# EAGLE design LED Controller (EAGLE 7.4.0)

## Sheet 1 of 5: Display
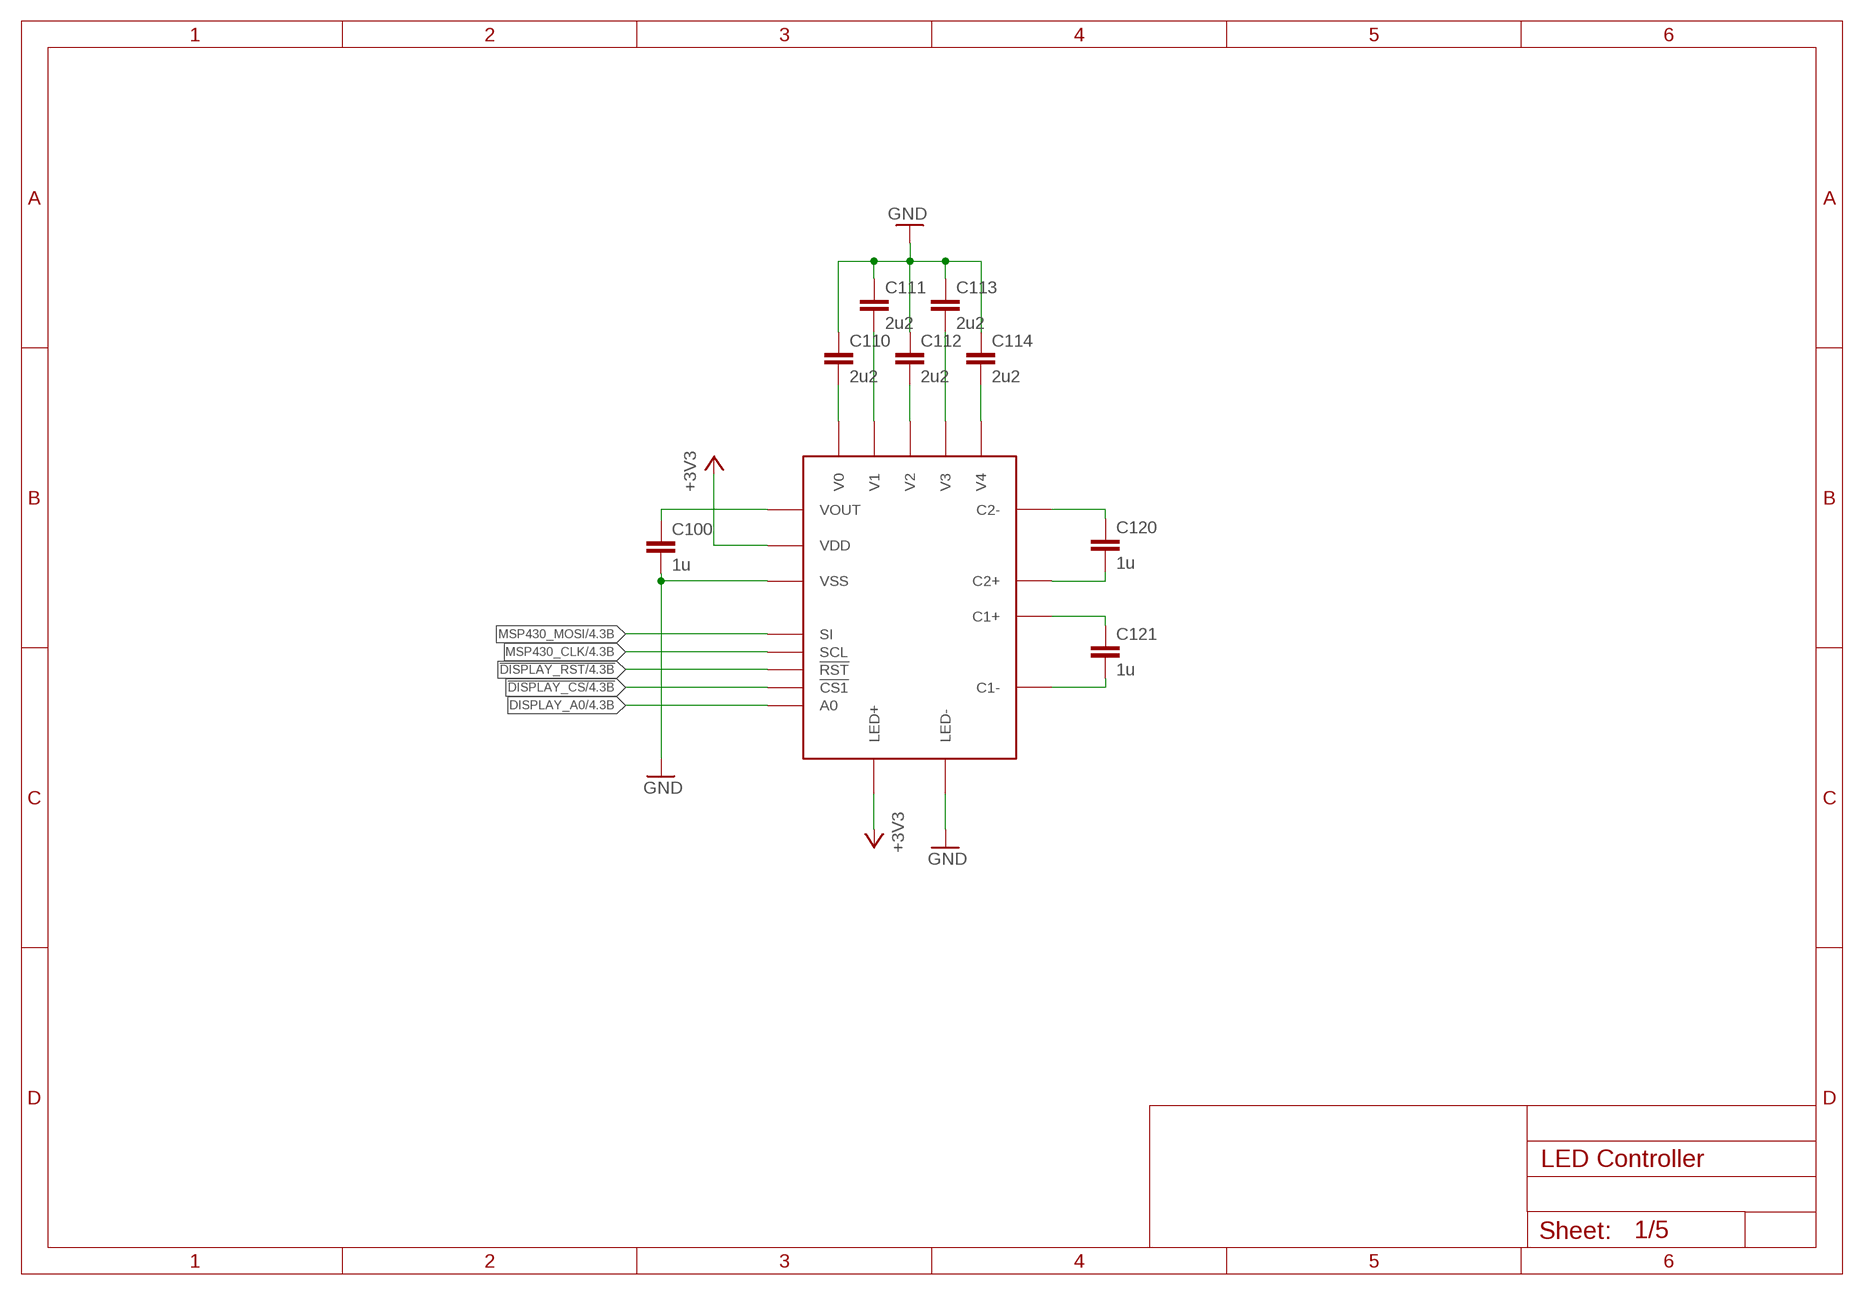
[diagram p0: schematic, sheet 1]

### Parts
C100  1u  C-EUC0603  [C0603]
C110  2u2  C-EUC0603  [C0603]
C111  2u2  C-EUC0603  [C0603]
C112  2u2  C-EUC0603  [C0603]
C113  2u2  C-EUC0603  [C0603]
C114  2u2  C-EUC0603  [C0603]
C120  1u  C-EUC0603  [C0603]
C121  1u  C-EUC0603  [C0603]
U$3  DISPLAY  [NHD-C12832A1Z-NSW-BBW-3V3]

### Nets
!DISPLAY_CS: U$3.P17(!CS1) ; also sheet 4
!DISPLAY_RST: U$3.P16(!RST) ; also sheet 4
+3V3: U$3.A(LED+) U$3.P12(VDD) ; also sheet 3,4,5
DISPLAY_A0: U$3.P15(A0) ; also sheet 4
GND: C100.2 C110.1 C111.1 C112.1 C113.1 C114.1 U$3.K(LED-) U$3.P11(VSS) ; also sheet 2,3,4,5
MSP430_CLK: U$3.P14(SCL) ; also sheet 4
MSP430_MOSI: U$3.P13(SI) ; also sheet 4
N$7: C110.2 U$3.P1(V0)
N$11: C111.2 U$3.P2(V1)
N$12: C112.2 U$3.P3(V2)
N$13: C113.2 U$3.P4(V3)
N$14: C114.2 U$3.P5(V4)
N$16: C120.2 U$3.P7(C2+)
N$17: C120.1 U$3.P6(C2-)
N$18: C121.1 U$3.P8(C1+)
N$19: C121.2 U$3.P9(C1-)
N$20: C100.1 U$3.P10(VOUT)

## Sheet 2 of 5: Boosted Converter
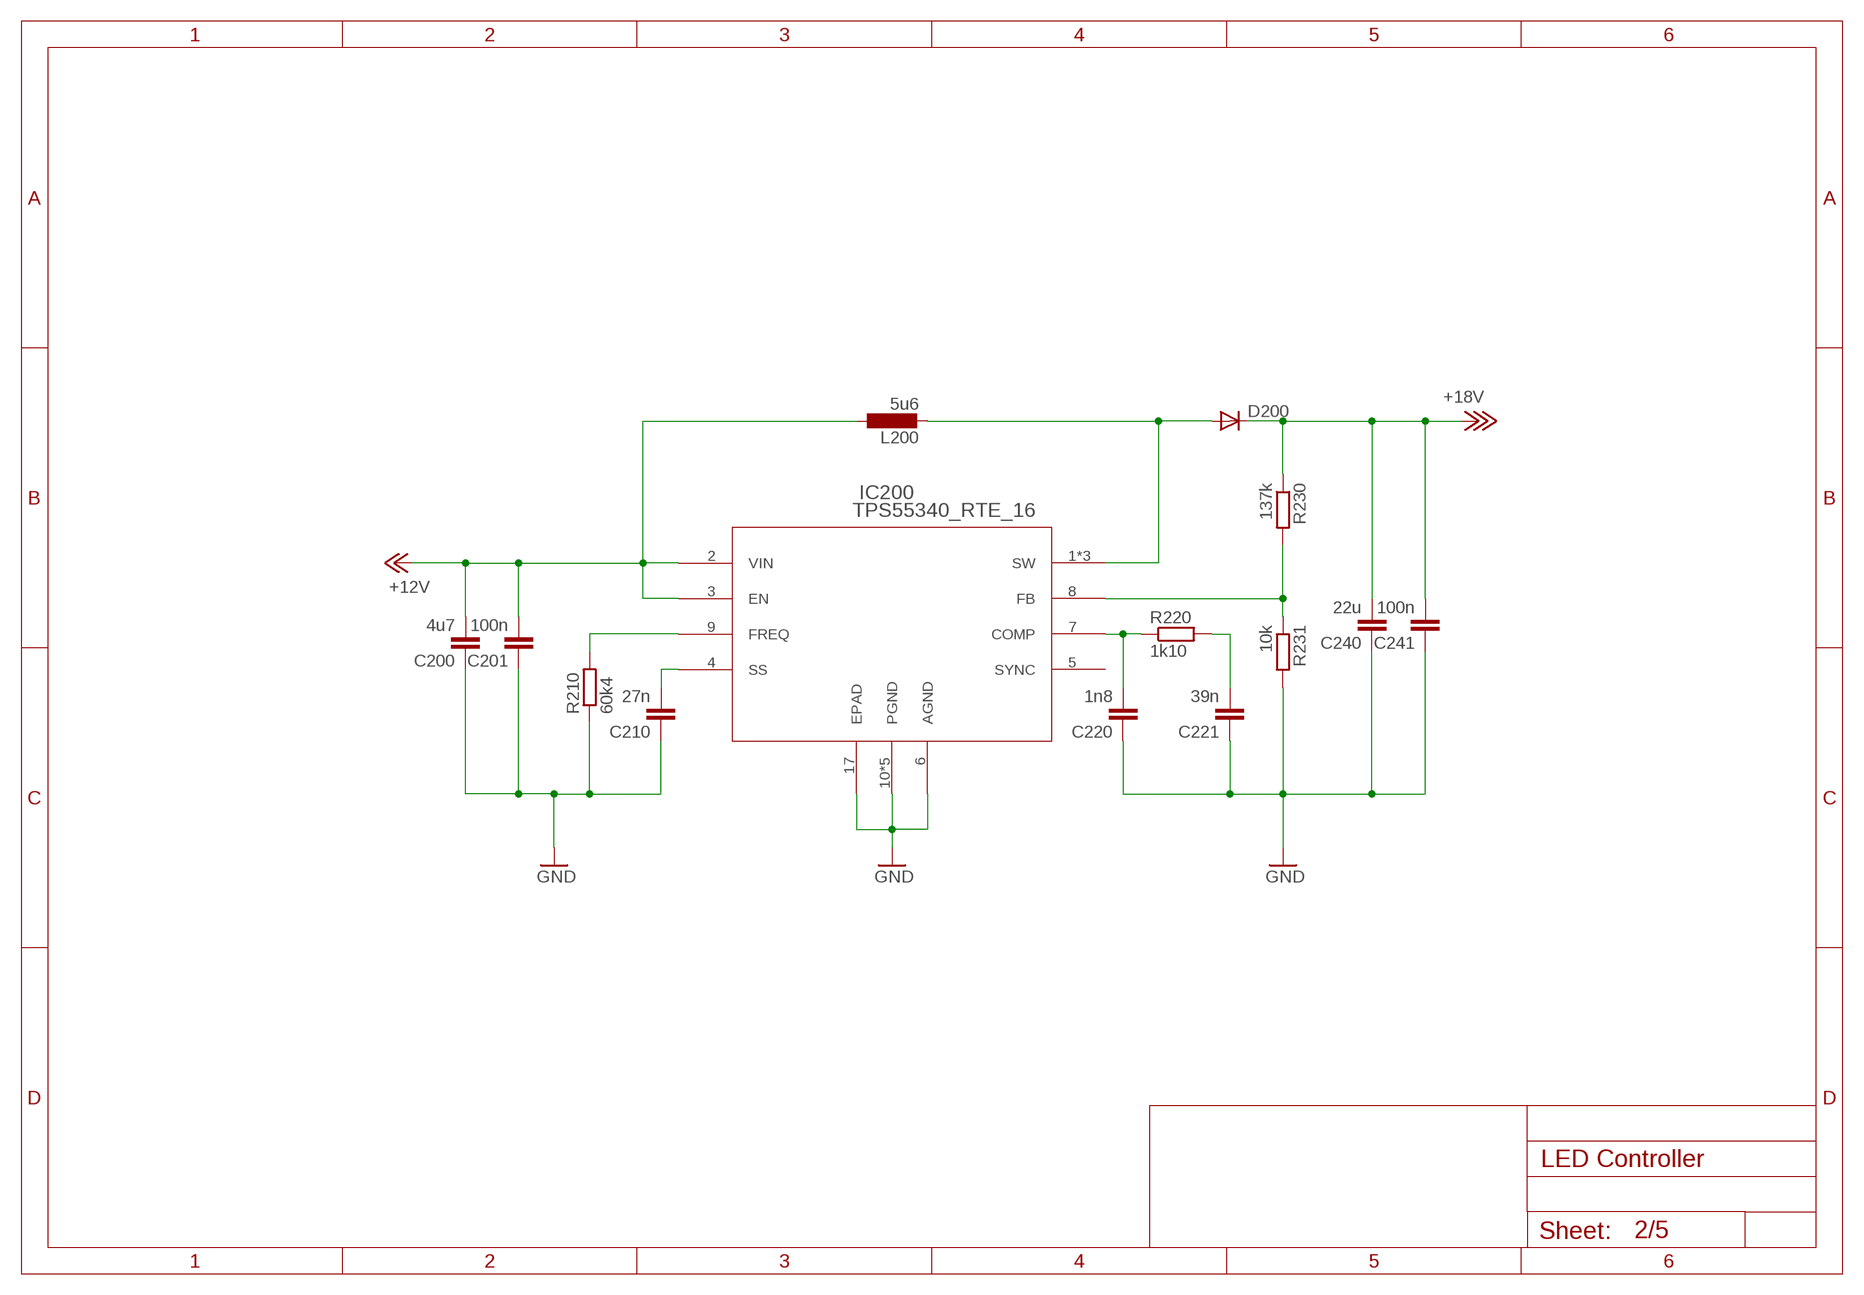
[diagram p1: schematic, sheet 2]

### Parts
C200  4u7  C-EUC1206  [C1206]
C201  100n  C-EUC1206  [C1206]
C210  27n  C-EUC0603  [C0603]
C220  1n8  C-EUC0603  [C0603]
C221  39n  C-EUC0603  [C0603]
C240  22u  C-EUC1210  [C1210]
C241  100n  C-EUC1206  [C1206]
D200  DIODE-SMC  [SMC]
IC200  TPS55340_RTE_16  [RTE16]
L200  5u6  L-EUSRP5030T  [SRP5030T]
R210  60k4  R-EU_R0603  [R0603]
R220  1k10  R-EU_R0603  [R0603]
R230  137k  R-EU_R0603  [R0603]
R231  10k  R-EU_R0603  [R0603]

### Nets
+12V: C200.2 C201.2 IC200.2(VIN) IC200.3(EN) L200.V_1 ; also sheet 3,5
+18V: C240.2 C241.2 D200.C R230.1 ; also sheet 5
GND: C200.1 C201.1 C210.1 C220.1 C221.1 C240.1 C241.1 IC200.6(AGND) IC200.10(PGND) IC200.11(PGND) IC200.12(PGND) IC200.13(PGND) IC200.14(PGND) IC200.17(EPAD) R210.1 R231.2 ; also sheet 1,3,4,5
N$3: C220.2 IC200.7(COMP) R220.1
N$4: D200.A IC200.1(SW) IC200.15(SW) IC200.16(SW) L200.V_2
N$6: IC200.8(FB) R230.2 R231.1
N$8: IC200.9(FREQ) R210.2
N$9: C210.2 IC200.4(SS)
N$10: C221.2 R220.2
Unconnected: IC200.5(SYNC)

## Sheet 3 of 5: Bucked Converter
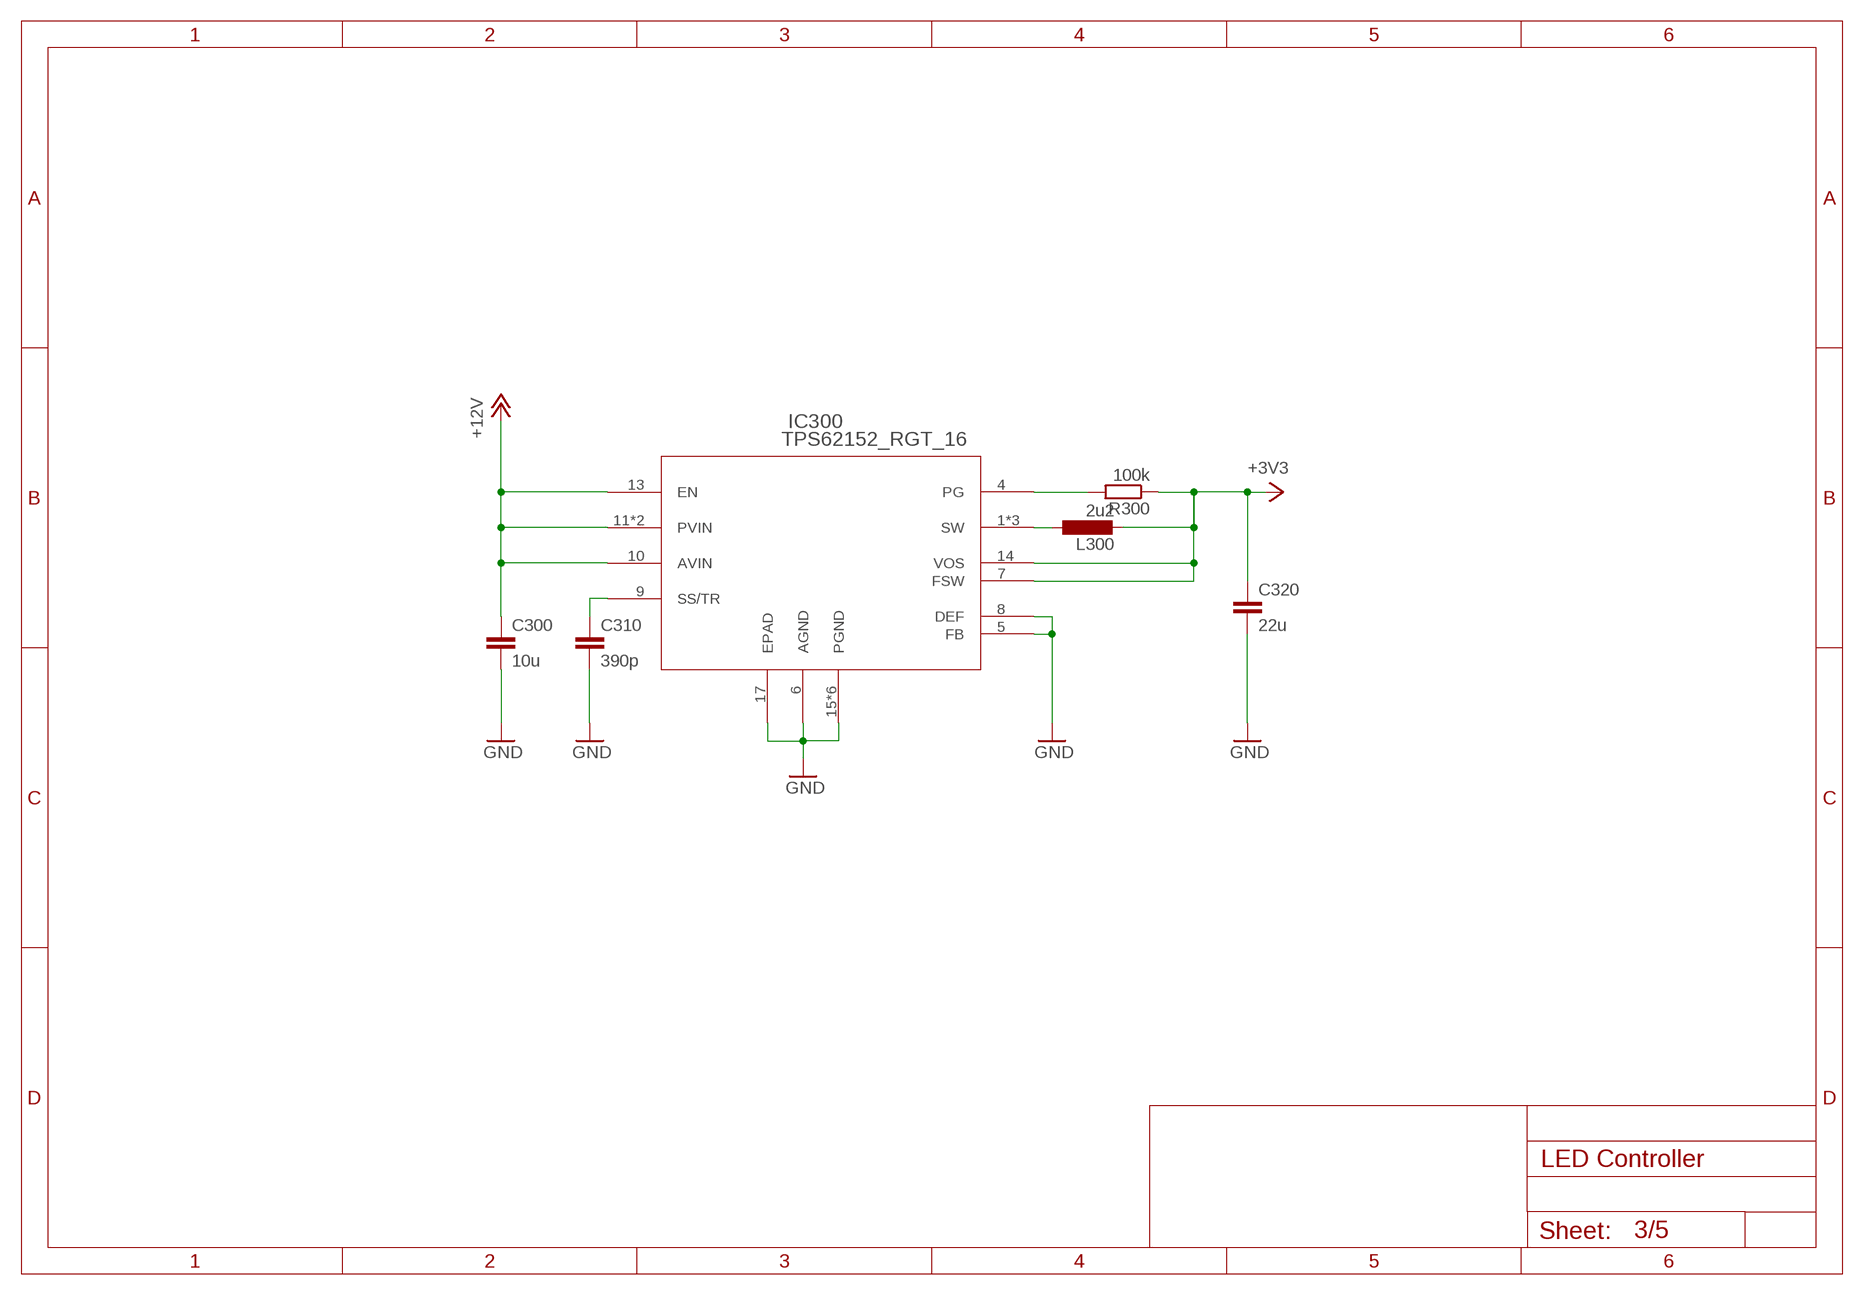
[diagram p2: schematic, sheet 3]

### Parts
C300  10u  C-EUC0805  [C0805]
C310  390p  C-EUC0603  [C0603]
C320  22u  C-EUC0805  [C0805]
IC300  TPS62152_RGT_16  [RGT16_1P7X1P7]
L300  2u2  L-EUSDR0403  [SDR0403]
R300  100k  R-EU_R0603  [R0603]

### Nets
+3V3: C320.1 IC300.7(FSW) IC300.14(VOS) L300.V_2 R300.1 ; also sheet 1,4,5
+12V: C300.1 IC300.10(AVIN) IC300.11(PVIN) IC300.12(PVIN) IC300.13(EN) ; also sheet 2,5
GND: C300.2 C310.2 C320.2 IC300.5(FB) IC300.6(AGND) IC300.8(DEF) IC300.15(PGND) IC300.16(PGND) IC300.17(EPAD) IC300.V(PGND) IC300.V_1(PGND) IC300.V_2(PGND) IC300.V_3(PGND) ; also sheet 1,2,4,5
N$1: IC300.1(SW) IC300.2(SW) IC300.3(SW) L300.V_1
N$2: IC300.4(PG) R300.2
N$5: C310.1 IC300.9(SS/TR)

## Sheet 4 of 5: Mikorcontroller
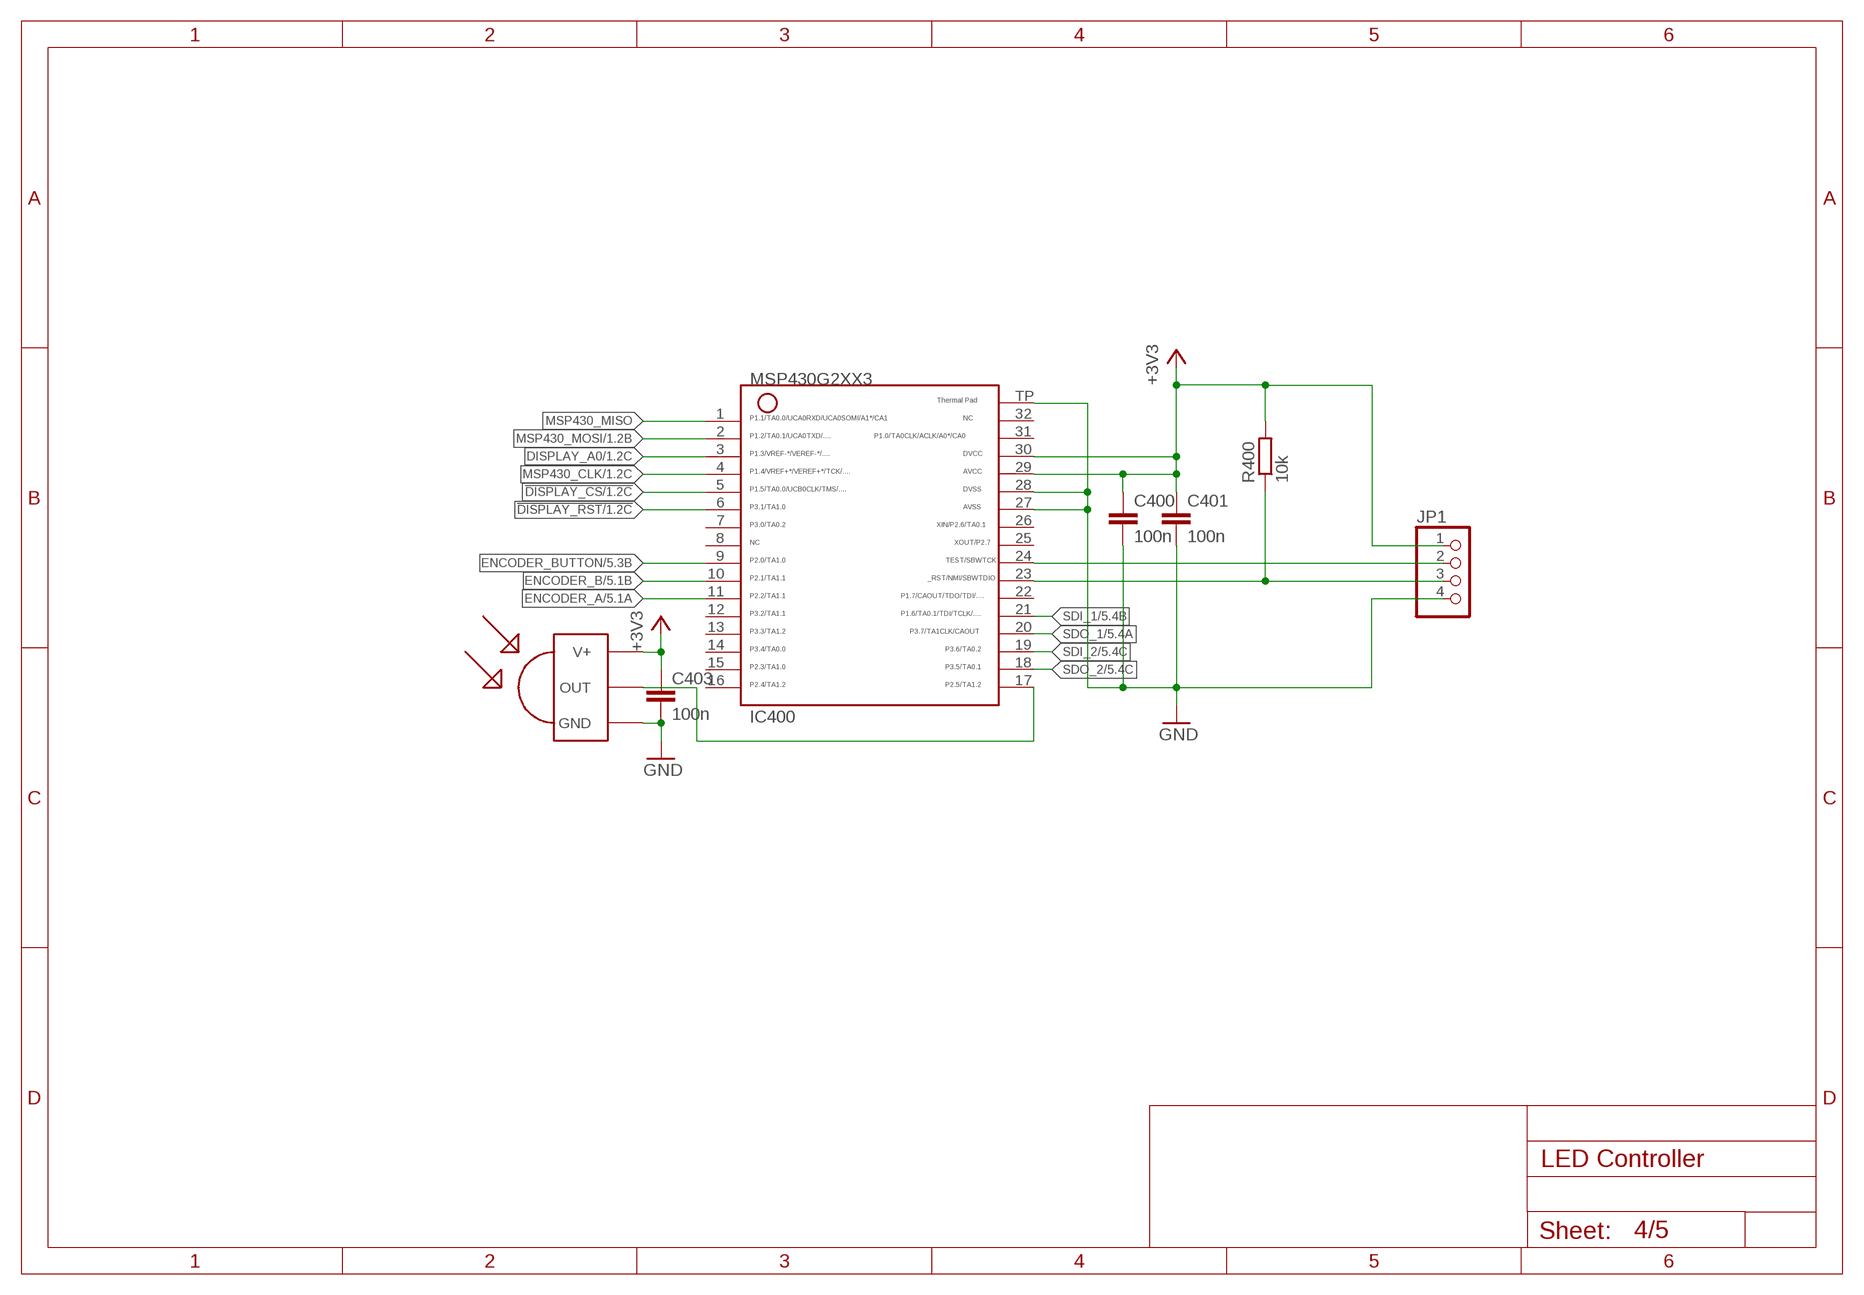
[diagram p3: schematic, sheet 4]

### Parts
C400  100n  C-EUC0603  [C0603]
C401  100n  C-EUC0603  [C0603]
C403  100n  C-EUC0603  [C0603]
IC400  G2XX3---RHB32  [RHB32]
JP1  PINHD-1X4  [1X04]
R400  10k  R-EU_R0603  [R0603]
U$1  TSOP1738  [TSOP17XX]

### Nets
!DISPLAY_CS: IC400.5 ; also sheet 1
!DISPLAY_RST: IC400.6 ; also sheet 1
+3V3: C400.1 C401.1 C403.1 IC400.29 IC400.30 JP1.1 R400.2 U$1.V+ ; also sheet 1,3,5
DISPLAY_A0: IC400.3 ; also sheet 1
ENCODER_A: IC400.11 ; also sheet 5
ENCODER_B: IC400.10 ; also sheet 5
ENCODER_BUTTON: IC400.9 ; also sheet 5
GND: C400.2 C401.2 C403.2 IC400.27 IC400.28 IC400.TP JP1.4 U$1.GND ; also sheet 1,2,3,5
MSP430_CLK: IC400.4 ; also sheet 1
MSP430_MISO: IC400.1
MSP430_MOSI: IC400.2 ; also sheet 1
N$15: IC400.24 JP1.2
N$23: IC400.23 JP1.3 R400.1
N$24: IC400.17 U$1.OUT
SDI_1: IC400.21 ; also sheet 5
SDI_2: IC400.19 ; also sheet 5
SDO_1: IC400.20 ; also sheet 5
SDO_2: IC400.18 ; also sheet 5
Unconnected: IC400.7 IC400.8 IC400.12 IC400.13 IC400.14 IC400.15 IC400.16 IC400.22 IC400.25 IC400.26 IC400.31 IC400.32

## Sheet 5 of 5: Encoder Connectors
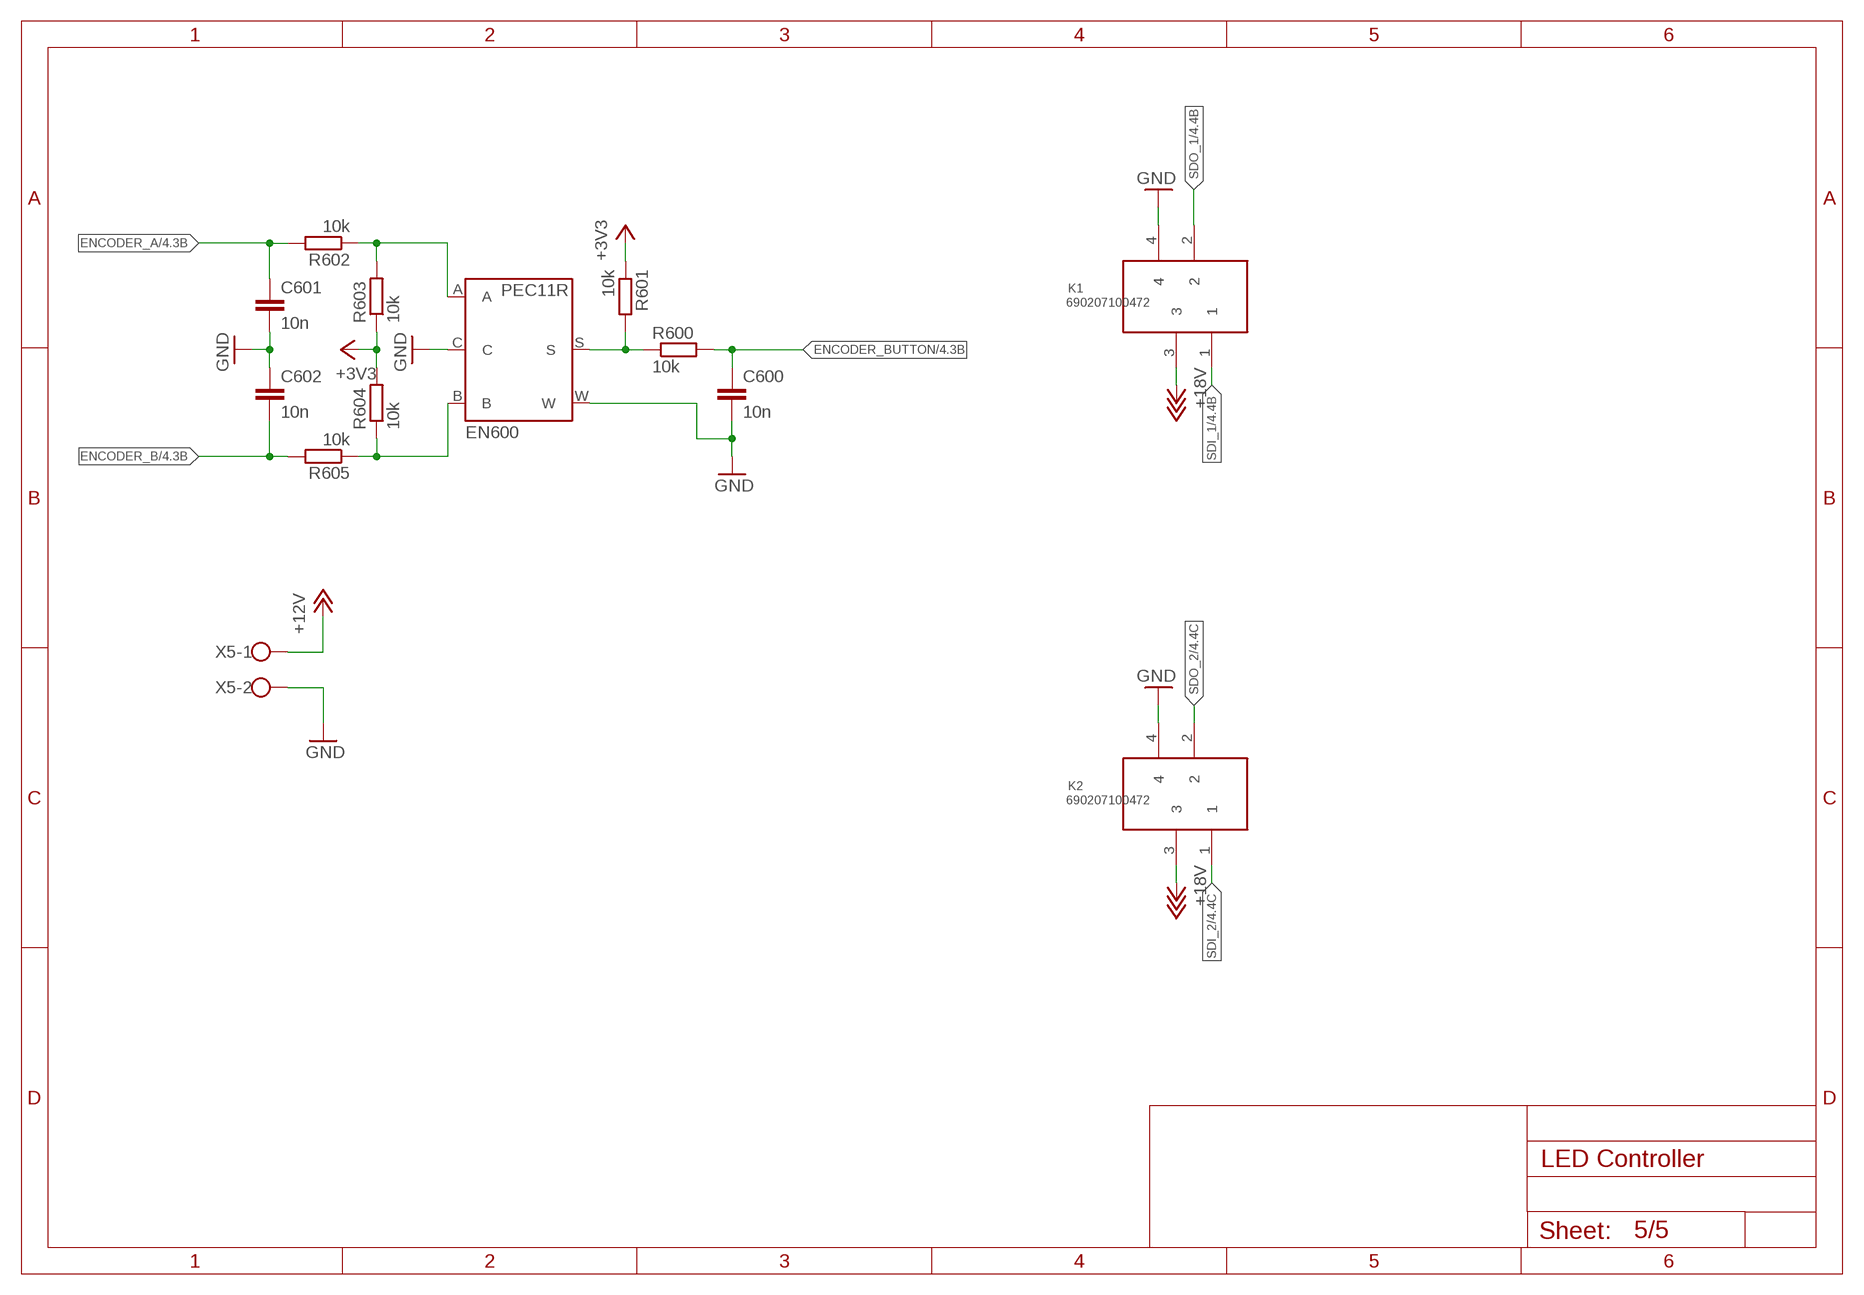
[diagram p4: schematic, sheet 5]

### Parts
C600  10n  C-EUC0603  [C0603]
C601  10n  C-EUC0603  [C0603]
C602  10n  C-EUC0603  [C0603]
EN600  PEC11R  [PEC11R]
K1  690207100472  [690207100472]
K2  690207100472  [690207100472]
R600  10k  R-EU_R0603  [R0603]
R601  10k  R-EU_R0603  [R0603]
R602  10k  R-EU_R0603  [R0603]
R603  10k  R-EU_R0603  [R0603]
R604  10k  R-EU_R0603  [R0603]
R605  10k  R-EU_R0603  [R0603]
X5  W237-102  [W237-102]

### Nets
+3V3: R601.1 R603.1 R604.2 ; also sheet 1,3,4
+12V: X5.1 ; also sheet 2,3
+18V: K1.3 K2.3 ; also sheet 2
ENCODER_A: C601.1 R602.2 ; also sheet 4
ENCODER_B: C602.2 R605.2 ; also sheet 4
ENCODER_BUTTON: C600.1 R600.2 ; also sheet 4
GND: C600.2 C601.2 C602.1 EN600.C EN600.W K1.4 K2.4 X5.2 ; also sheet 1,2,3,4
N$21: EN600.A R602.1 R603.2
N$22: EN600.B R604.1 R605.1
N$25: EN600.S R600.1 R601.2
SDI_1: K1.1 ; also sheet 4
SDI_2: K2.1 ; also sheet 4
SDO_1: K1.2 ; also sheet 4
SDO_2: K2.2 ; also sheet 4

## Library data of the parts
C100 C110-C114 C120 C121 C200 C201 C210 C220 C221 C240 C241 C300 C310 C320 C400 C401 C403 C600-C602 = rcl:C-EU: CAPACITOR, European symbol
D200 = diode:DIODE-: DIODE
EN600 = Radio Projekt:PEC11R
IC200 = LED Controller:TPS55340_RTE_16; MANUFACTURER_PART_NUMBER: tps55340_rte_16; VENDOR: TEXAS INSTRUMENTS
IC300 = LED Controller:TPS62152_RGT_16; DATASHEETURL: http://www.ti.com/lit/gpn/TPS62152; DESCRIPTION: 317V 1A Step-Down Converter in 3x3 QFN package; FAMILY_NAME: STEP-DOWN REGULATOR; GENERIC_PART_NUMBER: TPS62152; INDUSTRY_STD_PKG_TYPE: QFN; MANUFACTURER: Texas Instruments; MANUFACTURER_PART_NUMBER: tps62152_rgt_16; PACKAGE_DESIGNATOR: RGT; PIN_COUNT: 16; VENDOR: Texas Instruments
IC400 = TI_MSP430_v16:G2XX3---RHB32: MSP430G2XX1 QFN (RHB) 32 Pin Package
JP1 = pinhead:PINHD-1X4: PIN HEADER
K1 K2 = Wurth_Elektronik_Electromechanic_Wire_to_Board_Connectors_rev15c:690207100472: WR-MM Transition Connector, 4 Pins=>Code : WR-MM_Leiterplattenverbinder_690207101072 <http://katalog.we-online.de/media/thumbs2/eican/thb_WR-MM_Leiterplattenverbinder_690207101072.jpg> Details see: http://katalog.we-online.de/en/em/6902_0710_xx_72 Created 2014-06-04, Karrer Zheng 2014 (C) Würth Elektronik
L200 L300 = rcl:L-EU: INDUCTOR, European symbol
R210 R220 R230 R231 R300 R400 R600-R605 = rcl:R-EU_: RESISTOR, European symbol
U$1 = tsop:TSOP1738: IR Receiver and Demodulator
U$3 = LED Controller:DISPLAY
X5 = con-wago-500:W237-102: WAGO SCREW CLAMP; MPN: 237-102; OC_FARNELL: unknown; OC_NEWARK: 70K9898

## Board
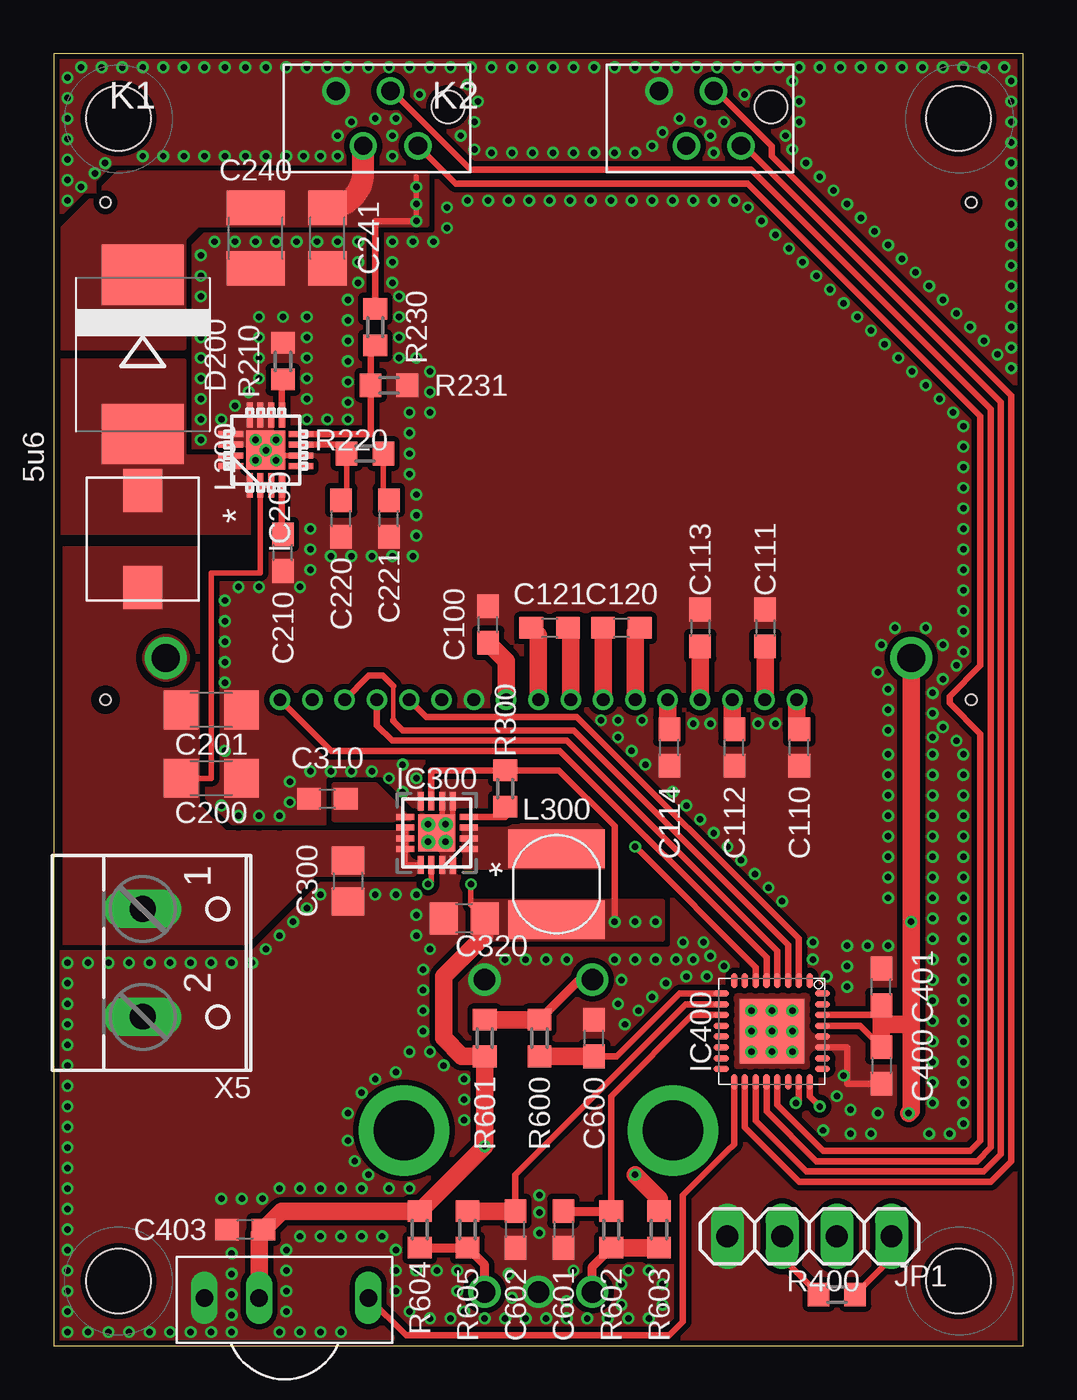
[diagram p5: board, top side]
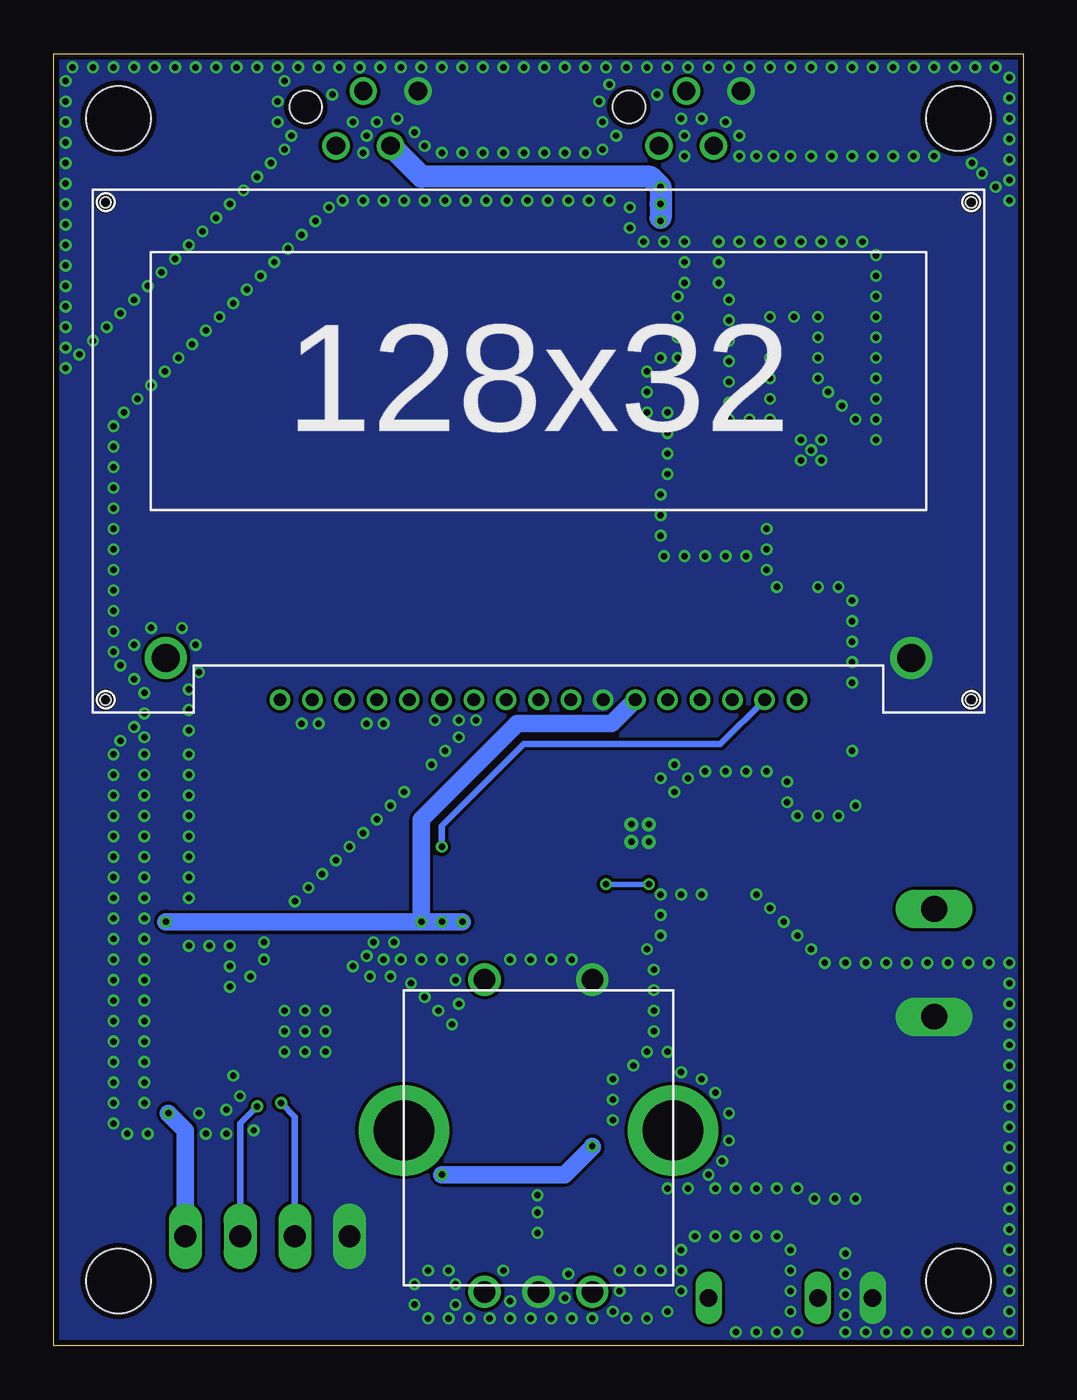
[diagram p6: board, bottom side, seen from below]

Size 45 x 60 mm. Coordinates in mm from the lower left corner, seen from the top.
Outline: 0,0 45,0 45,60 0,60 0,0
Copper layers (1*16): Top 0.018mm / dielectric 1.55mm / Bottom 0.018mm
Design rules "eC_2Layer_PClass6_BaseCopperO18_eCDefault *": minimum track width 0.15mm, minimum drill 0.3mm, track to track 0.15mm, track to pad 0.15mm, pad to pad 0.15mm, via to via 0.15mm, smd to smd 0mil, copper to edge 0.25mm, drill to drill 0.35mm, minimum pad ring 0.175mm, minimum via ring 0.125mm, stop-mask expansion 0mil, vias tented up to drill 0.45mm, thermal gap 0.2mm
Holes 3 mm at 3,3 42,3 3,57 42,57

### Footprints (pad centres in the part's own frame; a part is rotated, then mirrored left to right if it is on the bottom)
C0603 = smd 1.1 x 1: 1 -0.85,0; 2 0.85,0
C1206 = smd 1.6 x 1.8: 1 -1.4,0; 2 1.4,0
C1210 = smd 1.6 x 2.7: 1 -1.4,0; 2 1.4,0
C0805 = smd 1.3 x 1.5: 1 -0.95,0; 2 0.95,0
SMC = smd 2.8 x 3.8: A 3.7,0; C -3.7,0
PEC11R = drill 1: A -2.5,-7.5; B 2.5,-7.5; C 0,-7.5; S -2.5,7; W 2.5,7 | drill 2.8 pad 4: P$1 -6.25,0; P$2 6.25,0
RTE16 = smd 1.143 x 0.279: 1 -1.627,0.75; 2 -1.627,0.25; 3 -1.627,-0.25; 4 -1.627,-0.75; 9 1.627,-0.75; 10 1.627,-0.25; 11 1.627,0.25; 12 1.627,0.75 | smd 0.279 x 1.143: 5 -0.75,-1.627; 6 -0.25,-1.627; 7 0.25,-1.627; 8 0.75,-1.627; 13 0.75,1.627; 14 0.25,1.627; 15 -0.25,1.627; 16 -0.75,1.627 | smd 1.803 x 1.803: 17 0,0
RGT16_1P7X1P7 = smd 0.838 x 0.279: 1 -1.475,0.75; 2 -1.475,0.25; 3 -1.475,-0.25; 4 -1.475,-0.75; 9 1.475,-0.75; 10 1.475,-0.25; 11 1.475,0.25; 12 1.475,0.75 | smd 0.279 x 0.838: 5 -0.75,-1.475; 6 -0.25,-1.475; 7 0.25,-1.475; 8 0.75,-1.475; 13 0.75,1.475; 14 0.25,1.475; 15 -0.25,1.475; 16 -0.75,1.475 | smd 1.702 x 1.702: 17 0,0 | drill 0.3: V -0.406,-0.406; V_1 -0.406,0.406; V_2 0.406,-0.406; V_3 0.406,0.406
RHB32 = smd 0.7 x 0.3: 1 -2.35,1.75; 2 -2.35,1.25; 3 -2.35,0.75; 4 -2.35,0.25; 5 -2.35,-0.25; 6 -2.35,-0.75; 7 -2.35,-1.25; 8 -2.35,-1.75; 17 2.35,-1.75; 18 2.35,-1.25; 19 2.35,-0.75; 20 2.35,-0.25; 21 2.35,0.25; 22 2.35,0.75; 23 2.35,1.25; 24 2.35,1.75 | smd 0.3 x 0.7: 9 -1.75,-2.35; 10 -1.25,-2.35; 11 -0.75,-2.35; 12 -0.25,-2.35; 13 0.25,-2.35; 14 0.75,-2.35; 15 1.25,-2.35; 16 1.75,-2.35; 25 1.75,2.35; 26 1.25,2.35; 27 0.75,2.35; 28 0.25,2.35; 29 -0.25,2.35; 30 -0.75,2.35; 31 -1.25,2.35; 32 -1.75,2.35 | smd 3 x 3: TP 0,0
1X04 = drill 1.016 long: 1 -3.81,0; 2 -1.27,0; 3 1.27,0; 4 3.81,0
690207100472 = drill 0.85: 1 1.905,-1.27; 2 0.635,1.27; 3 -0.635,-1.27; 4 -1.905,1.27 | hole 1.5: 3.305,0.53
SRP5030T = smd 2 x 1.8: V_1 2.25,0; V_2 -2.25,0
SDR0403 = smd 4.5 x 1.8: V_1 0,1.65; V_2 0,-1.65
R0603 = smd 1 x 1.1: 1 -0.85,0; 2 0.85,0
TSOP17XX = drill 0.813 long: GND -3.81,0; OUT 3.81,0; V+ -1.27,0
NHD-C12832A1Z-NSW-BBW-3V3 = drill 1.3: A -17.3,1.95; K 17.3,1.95 | drill 0.6: P1 -12,0; P2 -10.5,0; P3 -9,0; P4 -7.5,0; P5 -6,0; P6 -4.5,0; P7 -3,0; P8 -1.5,0; P9 0,0; P10 1.5,0; P11 3,0; P12 4.5,0; P13 6,0; P14 7.5,0; P15 9,0; P16 10.5,0; P17 12,0 | hole 0.5: -20.1,23.1; 20.1,23.1; 20.1,0; -20.1,0
W237-102 = drill 1.194 long: 1 -2.5,-1.27; 2 2.5,-1.27

### Placement (x,y rotation side)
C100  20.16,33.5 90 top
C110  34.61,27.78 90 top
C111  33.02,33.34 270 top
C112  31.59,27.78 90 top
C113  30,33.34 270 top
C114  28.57,27.78 90 top
C120  26.35,33.34 180 top
C121  23.02,33.34 180 top
C200  7.3,26.35 180 top
C201  7.3,29.53 180 top
C210  10.64,36.83 90 top
C220  13.34,38.42 90 top
C221  15.56,38.42 90 top
C240  9.37,51.44 90 top
C241  12.7,51.44 90 top
C300  13.65,21.59 270 top
C310  12.7,25.4 180 top
C320  19.05,19.84 180 top
C400  38.42,13.02 270 top
C401  38.42,16.67 90 top
C403  8.89,5.4 180 top
C600  25.08,14.29 90 top
C601  23.65,5.4 270 top
C602  21.43,5.4 90 top
D200  4.13,46.04 270 top
EN600  22.5,10 0 bottom
IC200  9.84,41.59 90 top
IC300  17.78,23.81 180 top
IC400  33.34,14.61 270 top
JP1  35.08,5.08 180 top
K1  15,57 0 top
K2  30,57 0 top
L200  4.13,37.47 270 top
L300  23.34,21.43 0 top
R210  10.64,45.72 270 top
R220  14.45,41.43 0 top
R230  14.92,47.31 270 top
R231  15.56,44.61 0 top
R300  20.95,25.88 270 top
R400  36.35,2.38 0 top
R600  22.54,14.29 270 top
R601  20,14.29 90 top
R602  25.88,5.4 90 top
R603  28.1,5.4 270 top
R604  16.99,5.4 90 top
R605  19.21,5.4 90 top
U$1  10.79,2.22 0 top
U$3  22.5,30 0 bottom
X5  5.4,17.78 270 top

### Tracks (layer width: path | path; a pad name or v marks a point on that pad's centre or on a via)
!DISPLAY_CS
  Top 0.305: U$3.P17 12.88,27.62 23.5,27.62 33.09,18.03 IC400.5
!DISPLAY_RST  (via drill 0.3)
  Top 0.305: v26.99,23.18 32.59,17.58 IC400.6
  Bottom 0.305: U$3.P16 14.06,27.94 23.18,27.94 26.99,24.13 v26.99,23.18
+3V3  (via drill 0.3)
  Top 0.254: IC300.14 17.53,21.59 v17.37,21.43 | v19.37,21.43 19.37,20.48 C320.1
  Top 0.305: IC300.7 17.53,26.73 R300.1 23.44,26.73 26.04,24.13 v26.04,19.68 | JP1.1 38.89,4.07 R400.2 | IC400.30 37.95,15.36 C401.1 | C400.1 37.43,14.86 IC400.29
  Top 0.813: R603.1 28.1,6.83 v26.99,7.94 | C401.1 38.42,14.92 | 38.42,14.92 C400.1 | 38.42,14.92 39.8,14.92 | 39.8,14.92 v39.8,19.69 U$3.A | v39.69,10.79 39.8,10.91 39.8,14.92 | C320.1 20,19.05 19.05,18.1 18.1,17.14 18.1,14.29 18.95,13.44 R601.1 v20,9.26 R604.2 10.59,6.25 C403.1 9.53,5.18 U$1.V+
  Bottom 0.254: v17.37,21.43 v19.37,21.43
  Bottom 0.813: v26.99,7.94 21.27,7.94 20,9.21 v20,9.26 | v39.8,19.69 v26.04,19.69 v26.04,19.68 | v27.94,19.68 27.94,24.45 23.5,28.89 19.11,28.89 U$3.P12 | JP1.1 38.89,10 v39.69,10.79
  other vias: 26.99,19.68
  pour Top (isolate 0.406, rank 2, no thermals): 19.53,20.64 19.53,18.89 28.26,18.89 28.26,20.64
+12V
  Top 0.254: IC200.2 9.59,35.88 7.3,35.88 7.3,26.35 C200.2 | IC300.12 16.3,22.34 IC300.13
  Top 0.305: IC300.10 IC300.12 | IC200.3 IC200.2
  pour Top (isolate 0.406, no thermals): 0,36.99 6.67,36.99 6.67,25.08 7.94,23.81 16.83,23.81 16.83,21.91 12.06,21.91 8.89,18.73 0,18.73
+18V  (via drill 0.3)
  Top 0.254: v16.83,52.23 v16.83,53.02 v16.83,53.82 16.83,54.29
  Top 0.305: R230.1 14.92,52.23 v16.83,52.23
  Top 1.016: C241.2 arc90 14.37,54.5 K1.3
  Bottom 1.016: 16.83,52.39 v16.83,53.02 v16.83,53.82 17.3,54.29 27.93,54.29 K2.3
  pour Top (isolate 0.305, no thermals): 6.03,46.35 6.03,51.44 6.67,52.07 17.3,52.07 17.3,54.45 3.02,54.45 0.32,51.75 0.32,46.35
DISPLAY_A0
  Top 0.2: 15.75,29.05 15.75,30.64
  Top 0.305: IC400.3 34.09,18.62 24.13,28.57 16.19,28.57 15.75,29.02 15.75,29.05 | U$3.P15 14.62,31.11 15.27,31.11 15.75,30.64
ENCODER_A
  Top 0.305: R602.2 25.88,11.59 26.04,11.75 29.64,15.36 IC400.11
  Top 0.406: C601.1 R602.2
ENCODER_B
  Top 0.305: C602.2 21.43,7.94 25.88,12.38 29.35,15.86 IC400.10
  Top 0.813: R605.2 C602.2
ENCODER_BUTTON
  Top 0.305: C600.1 26.14,13.44 29.05,16.36 IC400.9
  Top 0.813: R600.2 C600.1
GND  (via drill 0.3)
  Top 0.254: IC200.6 9.84,41.34 IC200.17 | IC300.6 18.03,24.22 IC300.V 18.53,24.22 IC300.5
  Top 0.305: IC400.27 36.83,13.86 36.83,12.17 C400.2 | 18.03,24.22 IC300.17
  other vias: 32.38,15.56 33.34,15.56 34.29,15.56 34.29,14.61 33.34,14.61 32.38,14.61 32.38,13.65 33.34,13.65 34.29,13.65 9.37,42.07 10.32,42.07 10.32,41.12 9.37,41.12 9.84,41.59 7.78,25.08 8.57,24.61 9.53,24.61 10.48,24.61 7.94,27.62 7.94,30.8 7.94,31.75 7.94,32.7 7.94,33.66 7.94,34.61 8.57,35.24 9.53,35.24 11.43,35.24 11.91,36.04 11.91,36.99 11.91,37.94 10.95,25.24 10.95,26.19 11.91,26.67 12.86,26.67 13.81,26.67 14.76,26.67 15.56,26.35 16.19,25.72 16.83,26.35 16.19,26.99 12.86,36.67 13.81,36.67 14.76,36.67 15.72,36.67 16.67,36.67 16.83,37.62 16.83,38.58 16.83,39.53 16.51,40.48 16.51,41.43 16.51,42.39 16.51,43.34 6.83,42.07 6.83,43.02 6.83,43.97 6.83,44.93 6.83,45.88 6.83,46.83 6.83,47.78 6.83,48.74 6.83,49.69 6.83,50.64 7.46,51.28 8.41,51.28 9.37,51.28 10.32,51.28 11.27,51.28 12.22,51.28 13.18,51.28 14.13,51.28 14.13,50.32 14.13,49.37 13.65,48.58 13.65,47.62 13.65,46.67 13.65,45.72 13.65,44.77 13.65,43.81 13.65,43.02 12.7,43.02 11.75,43.02 7.78,43.02 8.41,43.66 9.05,44.29 9.53,44.93 9.53,45.88 11.75,45.88 11.75,44.93 11.75,43.97 11.75,46.83 9.53,46.83 9.53,47.78 10.64,47.78 11.75,47.78 0.64,53.18 1.27,53.82 1.91,54.45 2.38,54.93 4.13,55.24 5.08,55.24 6.03,55.24 6.99,55.24 7.94,55.24 8.89,55.24 9.84,55.24 10.79,55.24 11.59,55.24 0.64,54.13 0.64,55.09 0.64,56.04 0.64,56.99 0.64,57.94 0.64,58.9 1.27,59.37 2.22,59.37 3.17,59.37 4.13,59.37 5.08,59.37 6.03,59.37 6.99,59.37 7.94,59.37 8.89,59.37 9.84,59.37 10.79,59.37 11.75,59.37 12.7,59.37 13.65,59.37 14.61,59.37 15.56,59.37 16.51,59.37 17.46,59.37 18.41,59.37 19.37,59.37 20.32,59.37 21.27,59.37 22.23,59.37 23.18,59.37 24.13,59.37 25.08,59.37 26.04,59.37 26.99,59.37 27.94,59.37 28.89,59.37 29.84,59.37 30.8,59.37 31.75,59.37 32.7,59.37 33.66,59.37 34.61,59.37 35.56,59.37 19.53,55.56 20.32,55.4 21.27,55.4 22.23,55.4 23.18,55.4 24.13,55.4 25.08,55.4 26.04,55.4 18.89,56.2 19.53,56.83 19.68,57.78 26.99,55.4 27.78,55.72 28.26,56.36 29.05,56.99 15.72,55.24 13.81,56.83 14.92,56.99 15.72,56.2 15.88,56.99 36.51,59.37 37.47,59.37 38.42,59.37 39.37,59.37 40.32,59.37 41.27,59.37 42.23,59.37 43.18,59.37 44.13,59.37 44.45,58.74 44.45,57.78 44.45,56.83 44.45,55.88 44.45,54.93 44.45,53.98 44.45,53.02 44.45,52.07 44.45,51.12 44.45,50.16 44.45,49.21 44.45,48.26 44.45,47.31 44.45,46.35 44.45,45.4 0.64,17.78 1.59,17.78 2.54,17.78 3.49,17.78 4.45,17.78 5.4,17.78 6.35,17.78 7.3,17.78 8.26,17.78 9.21,17.78 9.84,18.41 10.48,19.05 11.11,19.68 11.75,20.32 12.38,20.95 0.64,16.83 0.64,15.88 0.64,14.92 0.64,13.97 0.64,13.02 0.64,12.06 0.64,11.11 0.64,10.16 0.64,9.21 0.64,8.26 0.64,7.3 0.64,6.35 0.64,5.4 0.64,4.45 0.64,3.49 0.64,2.54 0.64,1.59 0.64,0.64 1.59,0.64 2.54,0.64 3.49,0.64 4.45,0.64 5.4,0.64 6.35,0.64 7.3,0.64 8.26,0.64 10.48,0.64 11.43,0.64 12.38,0.64 13.34,0.64 14.92,20.95 15.88,20.95 16.83,20.95 16.83,20 16.83,19.05 17.46,18.41 17.14,17.46 17.14,16.51 17.14,15.56 17.14,14.61 17.46,13.65 18.1,13.02 19.05,12.38 19.05,11.43 19.05,10.48 16.51,13.65 15.88,12.7 14.92,12.38 14.29,11.75 13.65,10.79 13.65,9.53 13.97,8.57 14.61,7.94 15.56,7.3 16.51,7.3 14.29,7.3 13.34,7.3 12.38,7.3 11.43,7.3 10.48,7.3 9.68,6.83 8.73,6.83 7.78,6.83 8.26,1.43 8.26,2.38 8.26,3.33 8.26,4.29 10.79,1.59 10.79,2.54 10.79,3.49 10.79,4.45 11.43,5.08 12.38,5.08 13.34,5.08 14.29,5.08 15.24,5.08 15.88,4.45 15.88,3.49 16.83,3.49 17.78,3.49 18.73,3.49 18.73,2.54 19.05,1.59 15.88,2.54 16.51,1.59 17.46,1.27 18.41,1.27 20,1.27 20.95,1.27 21.91,1.27 22.86,1.27 23.81,1.27 24.77,1.27 25.72,1.27 26.67,1.27 27.62,1.27 28.26,1.91 28.26,2.86 27.62,3.49 26.67,3.49 26.35,2.86 26.35,1.91 21.27,2.22 21.11,3.33 24.13,3.49 23.81,2.06 22.54,6.99 22.54,6.19 22.54,5.24 20.95,17.94 21.91,17.94 22.86,17.94 23.81,17.94 26.04,17.94 26.99,17.94 27.94,17.94 28.89,17.94 29.21,18.73 30.16,18.73 30.48,18.1 29.69,17.94 31.11,17.62 30.32,17.14 29.37,17.14 28.42,16.83 27.78,16.19 27.15,15.56 26.51,14.92 26.19,15.88 26.35,16.99 17.46,43.34 17.46,44.29 17.46,45.24 16.83,45.88 16.03,45.88 16.03,46.83 16.03,47.78 16.03,48.74 15.72,49.37 15.72,50.32 15.72,51.28 16.67,51.28 17.62,51.28 18.26,51.91 18.26,52.86 19.21,53.18 20.16,53.18 21.11,53.18 22.07,53.18 23.02,53.18 23.97,53.18 24.92,53.18 25.88,53.18 26.83,53.18 27.78,53.18 28.73,53.18 29.69,53.18 30.64,53.18 31.59,53.18 32.23,52.86 32.86,52.23 33.5,51.59 34.13,50.96 34.77,50.32 35.4,49.69 36.04,49.05 36.67,48.42 37.31,47.78 37.94,47.15 38.58,46.51 39.21,45.88 39.85,45.24 40.48,44.61 41.12,43.97 41.75,43.34 42.23,42.7 42.23,41.75 42.23,40.8 42.23,39.85 42.23,38.89 42.23,37.94 42.23,36.99 42.23,36.04 42.23,35.08 42.23,34.13 42.23,33.18 42.23,32.23 41.91,31.59 41.27,30.96 40.8,30.32 40.8,29.37 41.27,28.73 41.91,28.1 42.23,27.46 42.23,26.51 42.23,25.56 42.23,24.61 42.23,23.65 42.23,22.7 42.23,21.75 42.23,20.8 42.23,19.84 42.23,18.89 42.23,17.94 42.23,16.99 42.23,16.03 42.23,15.08 42.23,14.13 42.23,13.18 42.23,12.22 42.23,11.27 42.23,10.32 41.59,9.84 40.64,9.84 37.94,9.84 36.99,9.84 35.72,10 36.99,10.95 36.35,11.59 36.67,12.54 38.26,10.79 40.8,27.46 40.8,26.51 40.8,25.56 40.8,24.61 40.8,23.65 40.8,22.7 40.8,21.75 40.8,20.8 40.8,19.84 40.8,18.89 40.8,17.94 40.8,16.99 40.8,16.03 40.8,15.08 40.8,14.13 40.8,13.18 40.8,12.22 40.8,28.26 40.8,11.27 41.27,32.54 40.48,33.34 39.05,33.34 38.42,32.54 38.26,31.27 38.73,30.48 38.73,29.53 38.73,28.57 38.73,27.46 38.73,26.51 38.73,25.56 38.73,24.61 38.73,23.65 38.73,22.7 38.73,21.75 38.73,20.8 36.83,18.57 38.73,18.57 37.78,18.57 36.83,17.62 36.83,16.67 35.88,17.14 35.24,17.94 35.24,18.73 33.81,20.64 33.18,21.27 32.54,21.91 31.91,22.54 31.27,23.18 30.64,23.81 30,24.45 29.37,25.08 28.73,25.72 27.46,26.99 26.83,27.62 26.19,28.26 25.4,29.05 26.19,29.05 27.3,29.05 29.69,28.89 30.48,28.89 32.7,28.89 33.5,28.89 43.81,46.04 43.18,46.67 42.55,47.31 41.91,47.94 41.27,48.58 40.64,49.21 40.01,49.85 39.37,50.48 38.73,51.12 38.1,51.75 37.47,52.39 36.83,53.02 36.2,53.66 35.56,54.29 34.92,54.93 34.29,55.56 33.97,56.2 34.61,56.83 30,56.83 30.48,56.2 30.64,55.4 31.11,56.83 32.07,58.1 34.29,58.74 34.61,57.78 12.38,55.24 13.18,55.24 13.18,56.2 16.99,58.1 19.21,58.58
  pour Bottom (rank 3, no thermals): 0,0 0,60 45,60 45,0
  pour Top (isolate 0.254, rank 3, no thermals): 0,0 0,60 45,60 45,0
MSP430_CLK
  Top 0.305: IC400.4 33.59,18.32 23.81,28.1 15.72,28.1 15,28.82 U$3.P14
MSP430_MOSI
  Top 0.305: U$3.P13 17.29,29.21 24.29,29.21 34.59,18.91 IC400.2
N$1
  pour Top (isolate 0.305, no thermals): 25.56,22.23 19.05,22.23 19.05,24.13 25.56,24.13
N$2
  Top 0.254: IC300.4
  Top 0.305: IC300.4 20.95,24.56 R300.2
N$3
  Top 0.254: 13.51,41.52 R220.1 13.6,39.53 C220.2
  Top 0.305: IC200.7 13.6,41.84 R220.1
N$4
  pour Top (isolate 0.305, rank 2, no thermals): 0.32,45.72 0.32,37.78 9.21,37.78 9.21,41.27 6.03,41.27 6.03,45.72
N$5
  pour Top (rank 2, no thermals): 16.51,24.45 13.02,24.45 13.02,26.04 14.92,26.04
N$6
  Top 0.305: IC200.8 14.71,42.34 R231.1 14.71,46.46 R230.2
N$7
  Top 0.813: C110.2 34.5,28.63 U$3.P1
N$8
  Top 0.305: IC200.9 10.59,44.87 R210.2
N$9
  Top 0.305: C210.2 10.59,37.68 IC200.4
N$10
  Top 0.254: R220.2 15.3,39.27 C221.2
N$11
  Top 0.813: U$3.P2 33.02,30 C111.2
N$12
  Top 0.813: C112.2 31.5,28.63 U$3.P3
N$13
  Top 0.813: U$3.P4 C113.2
N$14
  Top 0.813: C114.2 28.5,28.63 U$3.P5
N$15  (via drill 0.3)
  Top 0.305: IC400.24 35.09,11.59 v35.56,11.11
  Bottom 0.305: v35.56,11.11 36.35,10.32 JP1.2
N$16
  Top 0.813: U$3.P7 C120.2
N$17
  Top 0.813: U$3.P6 27,33.13 C120.1
N$18
  Top 0.813: U$3.P8 24,33.21 C121.1
N$19
  Top 0.813: U$3.P9 22.5,33.01 C121.2
N$20
  Top 0.813: U$3.P10 21,31.81 C100.1
N$21
  Top 0.406: EN600.A 25,3.67 R602.1
  Top 0.813: R602.1 R603.2
N$22
  Top 0.406: EN600.B 20,3.76 R605.1 R604.1
N$23  (via drill 0.3)
  Top 0.305: IC400.23 34.59,11.41 v34.45,11.27 | JP1.3 33.81,4.07 R400.1
  Bottom 0.305: v34.45,11.27 33.81,10.64 JP1.3
N$24
  Top 0.305: U$1.OUT 16.35,0.48 28.57,0.48 29.21,1.11 29.21,6.99 31.27,9.05 31.59,9.36 IC400.17
N$25
  Top 0.406: EN600.S 24.41,17 R600.1
  Top 0.813: R601.2 R600.1
SDI_1
  Top 0.305: IC400.21 33.59,11.18 35.72,9.05 42.55,9.05 43.02,9.53 43.02,28.42 41.59,29.84 41.59,30.16 43.02,31.59 43.02,43.18 32.23,53.98 18.66,53.98 K1.1
SDI_2
  Top 0.305: IC400.19 32.59,10.43 34.92,8.1 43.18,8.1 43.97,8.89 43.97,43.81 32.06,55.73 K2.1
SDO_1
  Top 0.305: IC400.20 33.09,10.89 35.4,8.57 42.86,8.57 43.5,9.21 43.5,43.5 32.38,54.61 19.37,54.61 15.71,58.27 K1.2
SDO_2
  Top 0.305: IC400.18 32.09,10.14 34.61,7.62 43.5,7.62 44.45,8.57 44.45,44.13 33.34,55.24 33.34,55.72 30.79,58.27 K2.2